# EAGLE design solderpaste_dispenser (EAGLE 9.4.0)
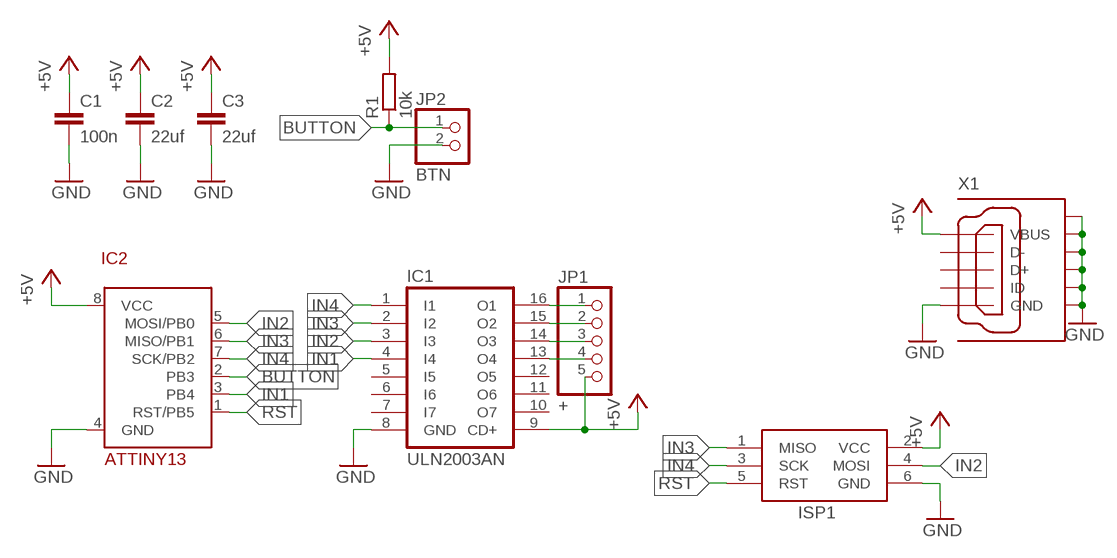
[diagram p0: schematic, sheet 1]

## Parts
C1  100n  C-EUC1206  [C1206]
C2  22uf  C-EUC1206  [C1206]
C3  22uf  C-EUC1206  [C1206]
IC1  ULN2003AN  [DIL16]
IC2  ATTINY13  ATTINY13-20SU  [SOIC8]
ISP1  AVRISP-6  [AVRISP]
JP1  +  PINHD-1X5  [1X05]
JP2  BTN  PINHD-1X2  [1X02]
R1  10k  R-EU_M1206  [M1206]
X1  GHI-CONNECTORS_10118192-0001LF  [GHI-CONNECTORS_10118192-0001LF(MICRO-USB-B-AMPHENOL-FCI)]

## Nets
+5V: C1.1 C2.1 C3.1 IC1.9(CD+) IC2.8(VCC) ISP1.2(VCC) JP1.5 R1.2 X1.VBUS
BUTTON: IC2.2(PB3) JP2.1 R1.1
GND: C1.2 C2.2 C3.2 IC1.8(GND) IC2.4(GND) ISP1.6(GND) JP2.2 X1.CGND1(SGND1) X1.CGND2(SGND2) X1.CGND3(SGND3) X1.CGND4(SGND4) X1.CGND5(SGND5) X1.CGND6(SGND6) X1.GND
IN1: IC1.4(I4) IC2.3(PB4)
IN2: IC1.3(I3) IC2.5(MOSI/PB0) ISP1.4(MOSI)
IN3: IC1.2(I2) IC2.6(MISO/PB1) ISP1.1(MISO)
IN4: IC1.1(I1) IC2.7(SCK/PB2) ISP1.3(SCK)
N$1: IC1.16(O1) JP1.1
N$2: IC1.15(O2) JP1.2
N$3: IC1.14(O3) JP1.3
N$4: IC1.13(O4) JP1.4
RST: IC2.1(RST/PB5) ISP1.5(RST)
Unconnected: IC1.5(I5) IC1.6(I6) IC1.7(I7) IC1.10(O7) IC1.11(O6) IC1.12(O5) X1.D+ X1.D- X1.ID

## Library data of the parts
C1-C3 = rcl:C-EU: CAPACITOR, European symbol; SPICEPREFIX: C
IC1 = uln-udn:ULN2003A: DRIVER ARRAY
IC2 = attiny13:ATTINY13-20*
ISP1 = adafruit:AVRISP: AVR ISP HEADER Standard 6 pin header for AVR programming
JP1 = pinhead:PINHD-1X5: PIN HEADER
JP2 = pinhead:PINHD-1X2: PIN HEADER
R1 = rcl:R-EU_: RESISTOR, European symbol; SPICEPREFIX: R
X1 = BeagleBone_Black_Wireless:GHI-CONNECTORS_10118192-0001LF: Amphenol FCI Micro USB Type B Complete Surface Mount (SMT) no guide holes

## Board
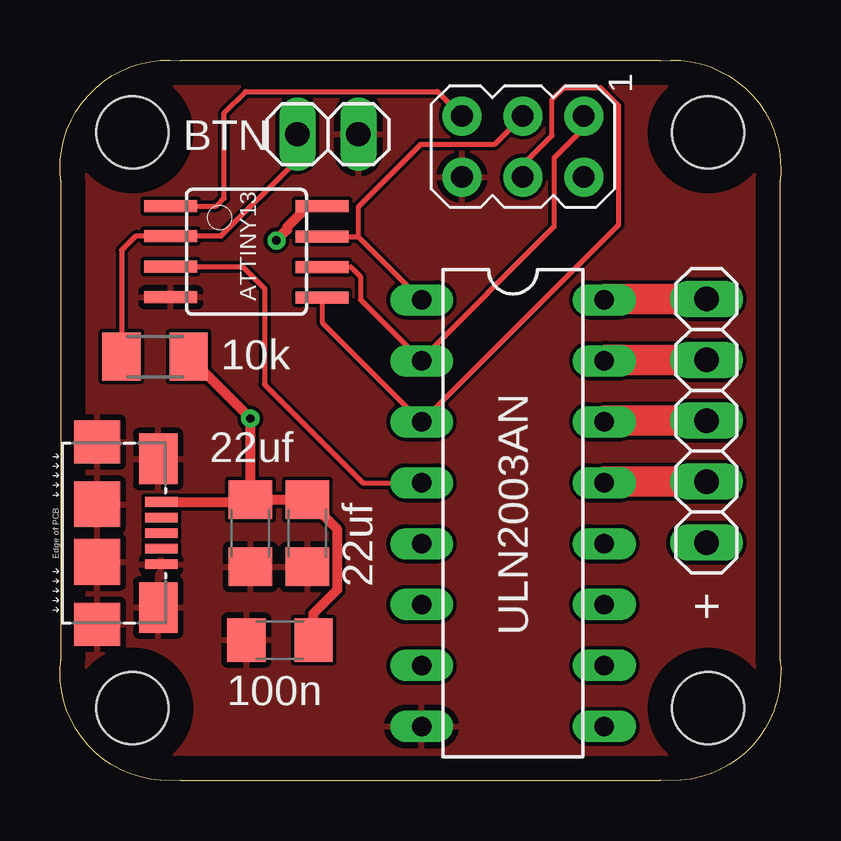
[diagram p1: board, top side]
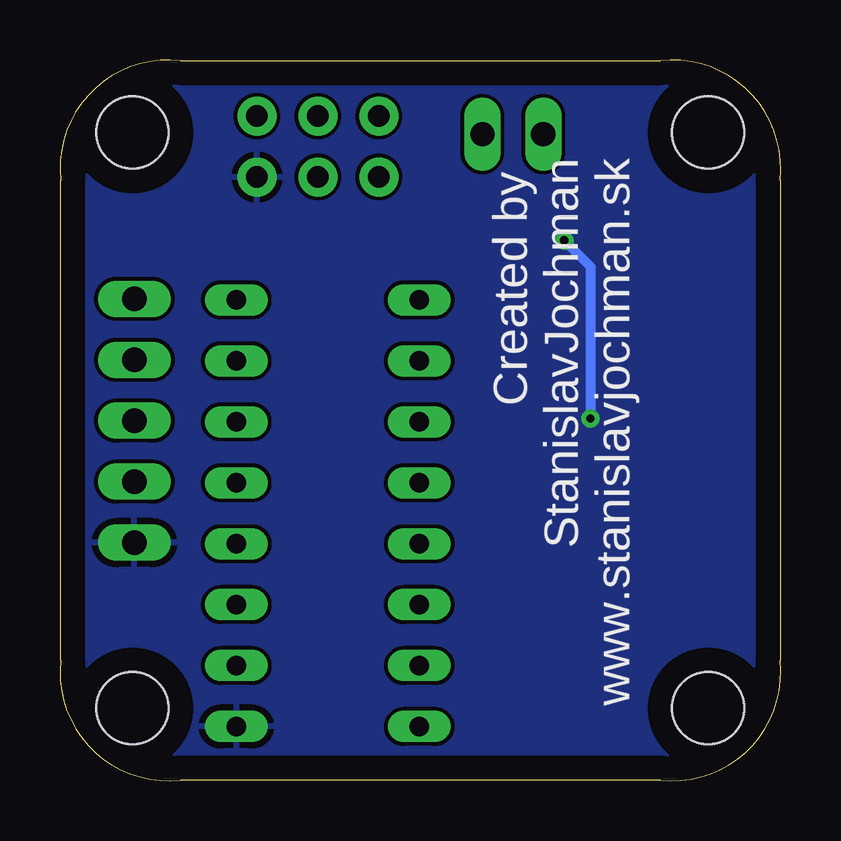
[diagram p2: board, bottom side, seen from below]

Size 30.05 x 30.05 mm. Coordinates in mm from the lower left corner, seen from the top.
Outline: 5.03,0.03 25.03,0.03 arc103 30.03,5.03 30.03,25.03 arc103 25.03,30.03 5.03,30.03 arc103 0.03,25.03 0.03,5.03 arc103 5.03,0.03
Copper layers (1*16): Top 0.035mm / dielectric 1.5mm / Bottom 0.035mm
Design rules "default": minimum track width 6mil, minimum drill 0.35mm, track to track 6mil, track to pad 6mil, pad to pad 6mil, via to via 6mil, smd to smd 6mil, copper to edge 40mil, drill to drill 6mil, minimum pad ring 10mil, minimum via ring 8mil, stop-mask expansion 4mil, vias tented up to drill 0mil, thermal gap 10mil
Holes 3 mm at 3.03,27.03 27.03,3.03 27.03,27.03 3.03,3.03

### Footprints (pad centres in the part's own frame; a part is rotated, then mirrored left to right if it is on the bottom)
C1206 = smd 1.6 x 1.8: 1 -1.4,0; 2 1.4,0
DIL16 = drill 0.813 long: 1 -8.89,-3.81; 2 -6.35,-3.81; 3 -3.81,-3.81; 4 -1.27,-3.81; 5 1.27,-3.81; 6 3.81,-3.81; 7 6.35,-3.81; 8 8.89,-3.81; 9 8.89,3.81; 10 6.35,3.81; 11 3.81,3.81; 12 1.27,3.81; 13 -1.27,3.81; 14 -3.81,3.81; 15 -6.35,3.81; 16 -8.89,3.81
SOIC8 = smd 0.5 x 2.2: 1 -1.905,-3.154; 2 -0.645,-3.154; 3 0.625,-3.154; 4 1.895,-3.154; 5 1.905,3.154; 6 0.635,3.154; 7 -0.635,3.154; 8 -1.905,3.154
AVRISP = drill 0.9 pad 1.626: 1 -1.27,2.54; 2 1.27,2.54; 3 -1.27,0; 4 1.27,0; 5 -1.27,-2.54; 6 1.27,-2.54
1X05 = drill 1.016 long: 1 -5.08,0; 2 -2.54,0; 3 0,0; 4 2.54,0; 5 5.08,0
1X02 = drill 1.016 long: 1 -1.27,0; 2 1.27,0
M1206 = smd 1.6 x 2: 1 -1.4,0; 2 1.4,0
GHI-CONNECTORS_10118192-0001LF(MICRO-USB-B-AMPHENOL-FCI) = smd 1.8 x 1.9: CGND1 -3.8,0; CGND4 3.8,0 | smd 1.9 x 1.9: CGND2 -1.2,0; CGND3 1.2,0 | smd 2.1 x 1.6: CGND5 3.1,2.55; CGND6 -3.1,2.55 | smd 0.4 x 1.35: D+ 0,2.675; D- -0.65,2.675; GND 1.3,2.675; ID 0.65,2.675; VBUS -1.3,2.675

### Placement (x,y rotation side)
C1  9.17,5.87 180 top
C2  7.94,10.33 270 top
C3  10.31,10.33 270 top
IC1  18.89,11.16 270 top
IC2  7.77,22.06 270 top
ISP1  19.3,26.44 270 top
JP1  26.95,15.01 270 top
JP2  11.17,26.96 0 top
R1  3.96,17.68 0 top
X1  1.55,10.33 270 top

### Tracks (layer width: path | path; a pad name or v marks a point on that pad's centre or on a via)
+5V  (via drill 0.35)
  Top 0.406: X1.VBUS 7.84,11.63 C2.1 | C2.1 C3.1 11.57,10.47 11.57,7.98 10.57,6.98 C1.1 | C2.1 v7.94,15.11 R1.2 | v9.03,22.53 9.47,22.97 9.47,23.09 10.35,23.97 IC2.8
  Bottom 0.406: v9.03,22.53 7.94,21.44 v7.94,15.11
  pour Bottom: -19.97,40.03 40.03,40.03 40.03,-19.97 -19.97,-19.97
BUTTON
  Top 0.203: JP2.1 9.9,25.9 6.71,22.71 IC2.2 3.15,22.71 2.56,22.12 2.56,18.03
  Top 0.406: 2.56,18.03 R1.1
GND
  pour Top: -19.97,40.03 40.03,40.03 40.03,-19.97 -19.97,-19.97
IN1
  Top 0.203: IC2.3 6.53,21.44 7.62,21.44 8.53,20.53 8.53,16.53 12.63,12.43 IC1.4
IN2
  Top 0.203: IC2.5 10.93,19.12 IC1.3 23.29,23.18 23.29,28.16 22.54,28.91 21.02,28.91 20.52,28.41 20.52,26.9 19.3,25.68 ISP1.4
IN3
  Top 0.203: IC2.6 12.13,21.43 12.53,21.03 12.53,20.06 15.04,17.54 | 15.04,17.54 IC1.2 | ISP1.1 21.84,27.21 20.6,25.97 20.6,23.1 15.04,17.54
IN4
  Top 0.203: IC2.7 12.43,22.7 | 12.43,22.7 IC1.1 | ISP1.3 18.11,26.53 15.03,26.53 12.43,23.93 12.43,22.7
N$1
  Top 1.27: IC1.16 22.74,20.09 JP1.1
N$2
  Top 1.27: IC1.15 22.74,17.55 JP1.2
N$3
  Top 1.27: IC1.14 22.74,15.01 JP1.3
N$4
  Top 1.27: IC1.13 22.74,12.47 JP1.4
RST
  Top 0.203: IC2.1 6.53,23.97 6.85,24.29 6.85,27.85 7.74,28.74 15.74,28.74 ISP1.5

### Text on the board
bPlace: Created by / StanislavJochman / www.stanislavjochman.sk